# EAGLE design proto (EAGLE 7.2.0)
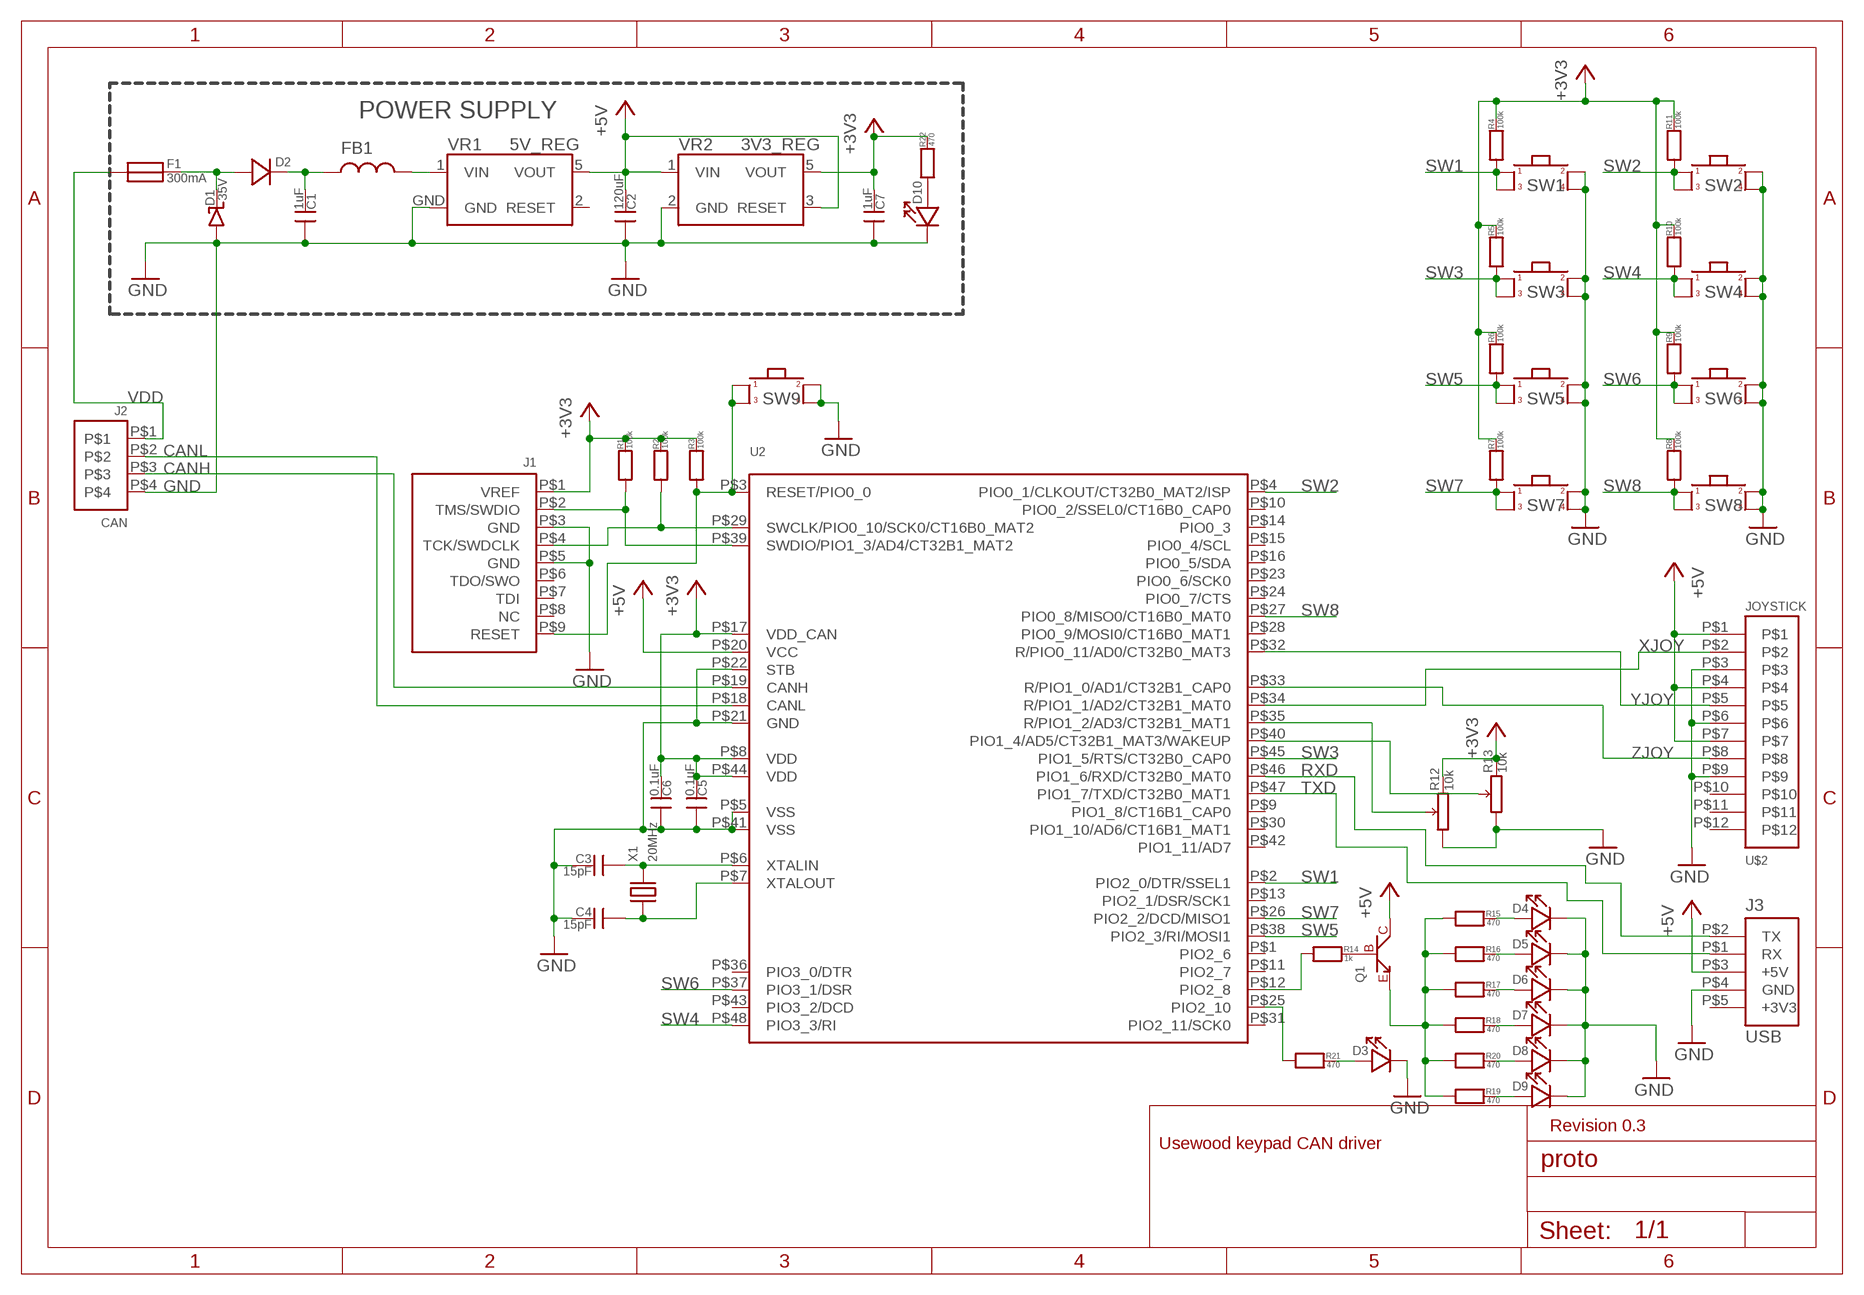
[diagram p0: schematic, sheet 1]

## Parts
C1  1uF  CAP0603  [0603]
C2  120uF  CAP0603  [0603]
C3  15pF  CAP0603  [0603]
C4  15pF  CAP0603  [0603]
C5  0.1uF  CAP0603  [0603]
C6  0.1uF  CAP0603  [0603]
C7  1uF  CAP0603  [0603]
D1  35V  DIODE_TVSDO-214AA  [DO-214AB]
D2  DIODEDO219AB  [DO219AB]
D3  LED0603  [0603]
D4  LED0603  [0603]
D5  LED0603  [0603]
D6  LED0603  [0603]
D7  LED0603  [0603]
D8  LED0603  [0603]
D9  LED0603  [0603]
D10  LED0603  [0603]
F1  300mA  FUSE100MA  [FUSE_100MA]
FB1  FERRITE0603  [0603]
J1  ARM_JTAG/SWD_HEADER_10_PINSMD  [ARM_10_PIN_JTAG/SWD_CONNECTOR]
J2  CAN  MOLEX_MICRO-FIT_4WAYTH  [MOLEX_MICRO-FIT_4WAY]
J3  USB  HEADER_USARTTH  [HEADER5_1]
Q1  NPN_TRANSISTORSOT323  [SOT323]
R1  100k  RES0603  [0603]
R2  100k  RES0603  [0603]
R3  100k  RES0603  [0603]
R4  100k  RES0603  [0603]
R5  100k  RES0603  [0603]
R6  100k  RES0603  [0603]
R7  100k  RES0603  [0603]
R8  100k  RES0603  [0603]
R9  100k  RES0603  [0603]
R10  100k  RES0603  [0603]
R11  100k  RES0603  [0603]
R12  10k  RES_POTRK09K1130C94  [RES_POT_RK09K1130C94]
R13  10k  RES_POTRK09K1130C94  [RES_POT_RK09K1130C94]
R14  1k  RES0603  [0603]
R15  470  RES0603  [0603]
R16  470  RES0603  [0603]
R17  470  RES0603  [0603]
R18  470  RES0603  [0603]
R19  470  RES0603  [0603]
R20  470  RES0603  [0603]
R21  470  RES0603  [0603]
R22  470  RES0603  [0603]
SW1  SWITCH12X12MM_CENTER_HOLE  [SWITCH_12X12MM_CENTER_HOLE]
SW2  SWITCH12X12MM_CENTER_HOLE  [SWITCH_12X12MM_CENTER_HOLE]
SW3  SWITCH12X12MM_CENTER_HOLE  [SWITCH_12X12MM_CENTER_HOLE]
SW4  SWITCH12X12MM_CENTER_HOLE  [SWITCH_12X12MM_CENTER_HOLE]
SW5  SWITCH12X12MM_CENTER_HOLE  [SWITCH_12X12MM_CENTER_HOLE]
SW6  SWITCH12X12MM_CENTER_HOLE  [SWITCH_12X12MM_CENTER_HOLE]
SW7  SWITCH12X12MM_CENTER_HOLE  [SWITCH_12X12MM_CENTER_HOLE]
SW8  SWITCH12X12MM_CENTER_HOLE  [SWITCH_12X12MM_CENTER_HOLE]
SW9  SWITCHREGULAR  [SWITCH_REGULAR]
U2  LPC11C22QFP48  [QFP48]
U$2  JOYSTICK  HEADER_MOLEX_MICRO-FIT  [MOLEX-43045-1000]
VR1  5V_REG  NCV8675175AA  [175AA]
VR2  3V3_REG  LP2985SOP5  [SOP5]
X1  20MHz  XTALSMD_5X3.2  [XTAL_SMD_5X3.2]

## Nets
+3V3: C5.1 C6.1 C7.1 J1.P$1(VREF) R1.1 R2.1 R3.1 R4.1 R5.1 R6.1 R7.1 R8.1 R9.1 R10.1 R11.1 R12.P$3 R13.P$3 R22.1 U2.P$8(VDD) U2.P$17(VDD_CAN) U2.P$44(VDD) VR2.5(VOUT)
+5V: C2.1 J3.P$3(+5V) Q1.M(C) U2.P$20(VCC) U$2.P$1 U$2.P$4 U$2.P$7 VR1.5(VOUT) VR2.1(VIN) VR2.3(RESET)
CANH: J2.P$3 U2.P$19(CANH)
CANL: J2.P$2 U2.P$18(CANL)
GND: C1.0 C2.0 C3.1 C4.1 C5.0 C6.0 C7.0 D1.P$1(P) D3.1 D4.1 D5.1 D6.1 D7.1 D8.1 D9.1 D10.1 J1.P$3(GND) J1.P$5(GND) J2.P$4 J3.P$4(GND) R12.P$1 R13.P$1 SW1.P$3 SW1.P$4 SW2.P$3 SW2.P$4 SW3.P$3 SW3.P$4 SW4.P$3 SW4.P$4 SW5.P$3 SW5.P$4 SW6.P$3 SW6.P$4 SW7.P$3 SW7.P$4 SW8.P$3 SW8.P$4 SW9.P$3 SW9.P$4 U2.P$5(VSS) U2.P$21(GND) U2.P$22(STB) U2.P$41(VSS) U$2.P$3 U$2.P$6 U$2.P$9 VR1.GND VR2.2(GND)
LED3: D3.0 R21.1
LED4: D4.0 R15.1
LED5: D5.0 R16.1
LED6: D6.0 R17.1
LED7: D7.0 R18.1
LED8: D8.0 R20.1
LED9: D9.0 R19.1
N$1: D1.P$2(N) D2.P$1(P) F1.P$2
N$2: C1.1 D2.P$2(N) FB1.0
N$3: D10.0 R22.0
N$4: FB1.1 VR1.1(VIN)
N$5: R14.0 U2.P$12(PIO2_8)
N$6: R21.0 U2.P$25(PIO2_10)
N$33: Q1.R(E) R15.0 R16.0 R17.0 R18.0 R19.0 R20.0
PIO1_2: R13.P$2 U2.P$40(PIO1_4/AD5/CT32B1_MAT3/WAKEUP)
PIO1_4: R12.P$2 U2.P$35(R/PIO1_2/AD3/CT32B1_MAT1)
Q1: Q1.L(B) R14.1
RESET: J1.P$9(RESET) R3.0 SW9.P$1 SW9.P$2 U2.P$3(RESET/PIO0_0)
RXD: J3.P$2(TX) U2.P$46(PIO1_6/RXD/CT32B0_MAT0)
SW1: R4.0 SW1.P$1 SW1.P$2 U2.P$2(PIO2_0/DTR/SSEL1)
SW2: R11.0 SW2.P$1 SW2.P$2 U2.P$4(PIO0_1/CLKOUT/CT32B0_MAT2/ISP)
SW3: R5.0 SW3.P$1 SW3.P$2 U2.P$45(PIO1_5/RTS/CT32B0_CAP0)
SW4: R10.0 SW4.P$1 SW4.P$2 U2.P$48(PIO3_3/RI)
SW5: R6.0 SW5.P$1 SW5.P$2 U2.P$38(PIO2_3/RI/MOSI1)
SW6: R9.0 SW6.P$1 SW6.P$2 U2.P$37(PIO3_1/DSR)
SW7: R7.0 SW7.P$1 SW7.P$2 U2.P$26(PIO2_2/DCD/MISO1)
SW8: R8.0 SW8.P$1 SW8.P$2 U2.P$27(PIO0_8/MISO0/CT16B0_MAT0)
SWDCLK: J1.P$4(TCK/SWDCLK) R2.0 U2.P$29(SWCLK/PIO0_10/SCK0/CT16B0_MAT2)
SWDIO: J1.P$2(TMS/SWDIO) R1.0 U2.P$39(SWDIO/PIO1_3/AD4/CT32B1_MAT2)
TXD: J3.P$1(RX) U2.P$47(PIO1_7/TXD/CT32B0_MAT1)
VDD: F1.P$1 J2.P$1
XJOY: U2.P$34(R/PIO1_1/AD2/CT32B1_MAT0) U$2.P$2
XTALIN: C3.0 U2.P$6(XTALIN) X1.P$2
XTALOUT: C4.0 U2.P$7(XTALOUT) X1.P$1
YJOY: U2.P$32(R/PIO0_11/AD0/CT32B0_MAT3) U$2.P$5
ZJOY: U2.P$33(R/PIO1_0/AD1/CT32B1_CAP0) U$2.P$8
Unconnected: J1.P$6(TDO/SWO) J1.P$7(TDI) J1.P$8(NC) J3.P$5(+3V3) U2.P$1(PIO2_6) U2.P$9(PIO1_8/CT16B1_CAP0) U2.P$10(PIO0_2/SSEL0/CT16B0_CAP0) U2.P$11(PIO2_7) U2.P$13(PIO2_1/DSR/SCK1) U2.P$14(PIO0_3) U2.P$15(PIO0_4/SCL) U2.P$16(PIO0_5/SDA) U2.P$23(PIO0_6/SCK0) U2.P$24(PIO0_7/CTS) U2.P$28(PIO0_9/MOSI0/CT16B0_MAT1) U2.P$30(PIO1_10/AD6/CT16B1_MAT1) U2.P$31(PIO2_11/SCK0) U2.P$36(PIO3_0/DTR) U2.P$42(PIO1_11/AD7) U2.P$43(PIO3_2/DCD) U$2.P$10 U$2.P$11 U$2.P$12 VR1.2(RESET)

## Notes on the sheet
- POWER SUPPLY
- Revision 0.3
- Usewood keypad CAN driver

## Library data of the parts
C1-C7 = usevolt:CAP
D1 = usevolt:DIODE_TVS
D2 = usevolt:DIODE
D3-D10 = usevolt:LED
F1 = usevolt:FUSE
FB1 = usevolt:FERRITE
J1 = usevolt:ARM_JTAG/SWD_HEADER_10_PIN: ARM Olimex Debugger 10 pin header, 0.05 inch
J2 = usevolt:MOLEX_MICRO-FIT_4WAY: MOLEX 43045-0401 HEADER, RIGHT ANGLE, DUAL ROW, 4 WAY, 1704306
J3 = usevolt:HEADER_USART: USB to USART module header
Q1 = usevolt:NPN_TRANSISTOR: http://www.farnell.com/datasheets/1697409.pdf 9294511
R1-R11 R14-R22 = usevolt:RES
R12 R13 = usevolt:RES_POT
SW1-SW9 = usevolt:SWITCH
U2 = usevolt:LPC11C22: NXP MCU, 32BIT, CORTEX-M0, 50MHZ, LQFP-48, 2314753
U$2 = usevolt:HEADER_MOLEX_MICRO-FIT: MOLEX HEADER, MICRO-FIT, R/A, DUAL ROW, 10 WAY, 1012255
VR1 = usevolt:NCV8675: ON SEMICONDUCTOR NCV8675DT50RKG LDO, 350MA, 5V, 5DPAK, 1885151
VR2 = usevolt:LP2985: TEXAS INSTRUMENTS LP2985IM5-3.3 V REG LDO +3.3V, SMD, 2985, SOT235
X1 = usevolt:XTAL

## Board
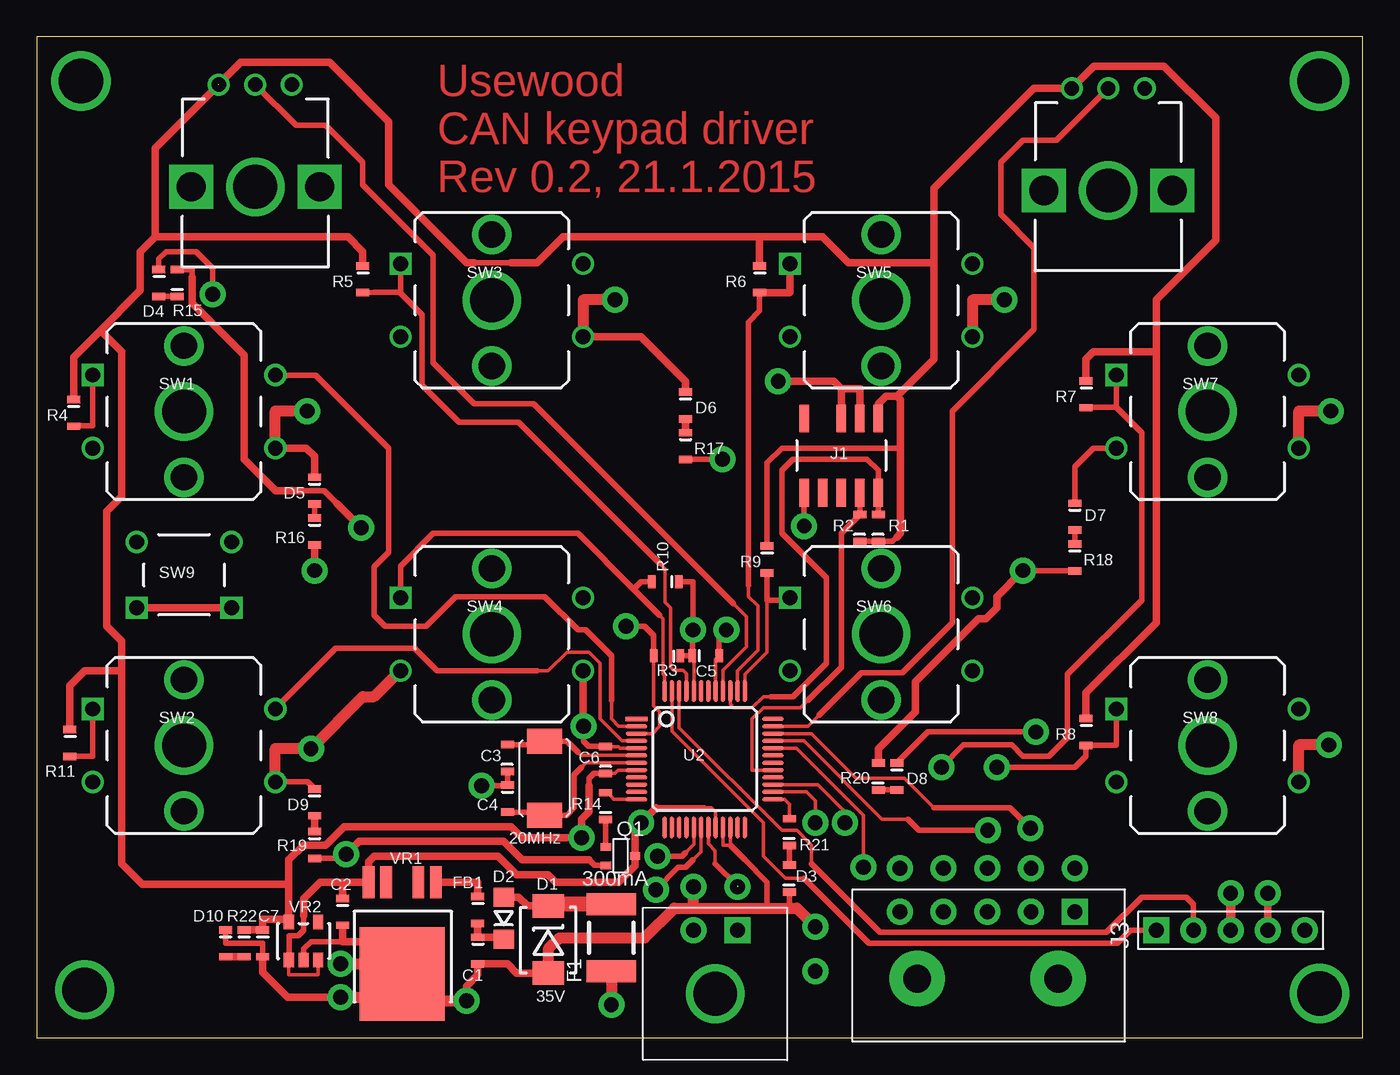
[diagram p1: board, top side]
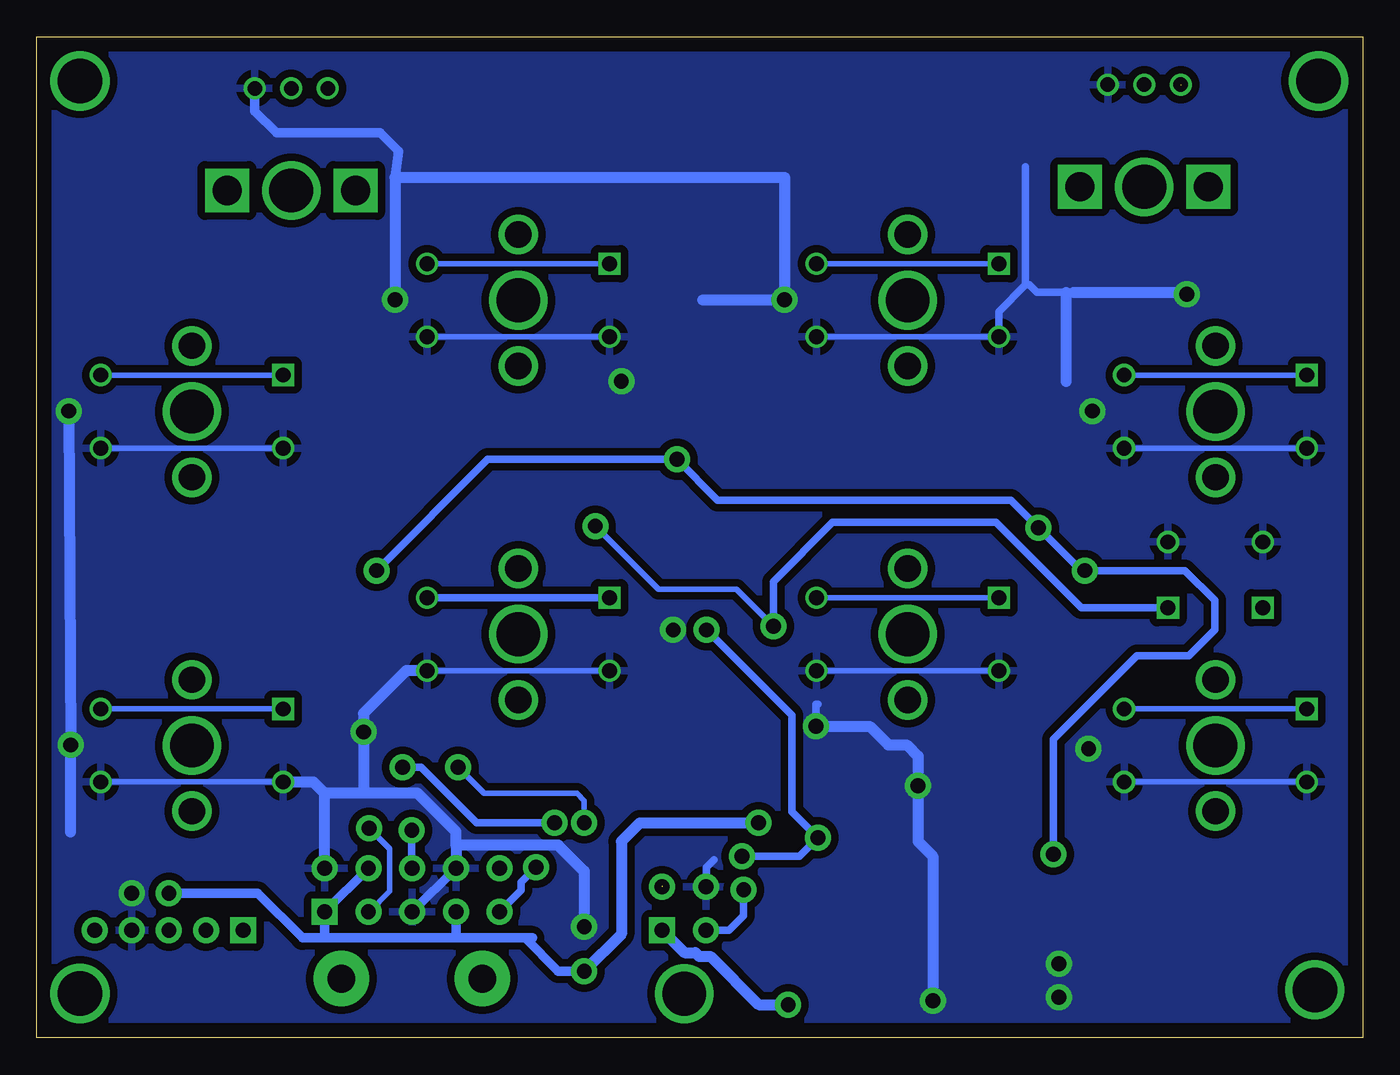
[diagram p2: board, bottom side, seen from below]

Size 90.86 x 68.57 mm. Coordinates in mm from the lower left corner, seen from the top.
Outline: 0,0 90.86,0 90.86,68.57 0,68.57 0,0
Copper layers (1*16): Top 0.035mm / dielectric 1.5mm / Bottom 0.035mm
Design rules "default *": minimum track width 10mil, minimum drill 24mil, track to track 8mil, track to pad 8mil, pad to pad 8mil, via to via 8mil, smd to smd 8mil, copper to edge 40mil, drill to drill 8mil, minimum pad ring 10mil, minimum via ring 8mil, stop-mask expansion 4mil, vias tented up to drill 0mil, thermal gap 20mil

### Footprints (pad centres in the part's own frame; a part is rotated, then mirrored left to right if it is on the bottom)
0603 = smd 0.508 x 0.889: 0 -1.041,0; 1 0.8,0
DO-214AB = smd 1.62 x 2.18: P$1 0,0; P$2 4.6,0
DO219AB = smd 1.3 x 1.4: P$1 0,0; P$2 2.9,0
FUSE_100MA = smd 1.5 x 3.41: P$1 0,0; P$2 4.572,0
ARM_10_PIN_JTAG/SWD_CONNECTOR = smd 1.905 x 0.635: P$1 -1.27,0; P$2 3.81,0; P$3 -1.27,-1.27; P$4 3.81,-1.27; P$5 -1.27,-2.54; P$6 3.81,-2.54; P$7 3.81,-3.81; P$8 -1.27,-5.08; P$9 3.81,-5.08
MOLEX_MICRO-FIT_4WAY = drill 1.016 pad 1.778 square: P$1 1.27,2.032 | drill 1.016 pad 1.778: P$2 -1.727,2.032; P$3 1.27,5.029; P$4 -1.727,5.029 | drill 3: P$5 -0.25,-2.3
HEADER5_1 = drill 1.016 pad 1.778 square: P$1 0,0 | drill 1.016 pad 1.778: P$2 0,-2.54; P$3 0,-5.08; P$4 0,-7.62; P$5 0,-10.16
SOT323 = smd 0.5 x 0.7: L 0,0; M 0.63,2; R 1.27,0
RES_POT_RK09K1130C94 = drill 1: P$1 -2.5,0; P$2 0,0; P$3 2.5,0 | drill 2 square: P$4 -4.4,7; P$5 4.4,7 | drill 3 pad 2.9: P$6 0,7
SWITCH_12X12MM_CENTER_HOLE = drill 1.016 square: P$1 -3,4.75 | drill 1.016: P$2 9.5,4.75; P$3 -3,-0.25; P$4 9.5,-0.25 | drill 3 pad 2.9: P$5 3.25,2.25 | drill 1.8 pad 1.7: P$10 3.25,6.75; P$11 3.25,-2.25
SWITCH_REGULAR = drill 1.016 square: P$1 0,0; P$2 6.5,0 | drill 1.016: P$3 6.5,4.5; P$4 0,4.5
QFP48 = smd 1.5 x 0.28: P$1 0.2,0; P$2 0.2,-0.5; P$3 0.2,-1; P$4 0.2,-1.5; P$5 0.2,-2; P$6 0.2,-2.5; P$7 0.2,-3; P$8 0.2,-3.5; P$9 0.2,-4; P$10 0.2,-4.5; P$11 0.2,-5; P$12 0.2,-5.5; P$25 9.55,-5.5; P$26 9.55,-5; P$27 9.55,-4.5; P$28 9.55,-4; P$29 9.55,-3.5; P$30 9.55,-3; P$31 9.55,-2.5; P$32 9.55,-2; P$33 9.55,-1.5; P$34 9.55,-1; P$35 9.55,-0.5; P$36 9.55,0 | smd 0.28 x 1.5: P$13 2.125,-7.425; P$14 2.625,-7.425; P$15 3.125,-7.425; P$16 3.625,-7.425; P$17 4.125,-7.425; P$18 4.625,-7.425; P$19 5.125,-7.425; P$20 5.625,-7.425; P$21 6.125,-7.425; P$22 6.625,-7.425; P$23 7.125,-7.425; P$24 7.625,-7.425; P$37 7.625,1.925; P$38 7.125,1.925; P$39 6.625,1.925; P$40 6.125,1.925; P$41 5.625,1.925; P$42 5.125,1.925; P$43 4.625,1.925; P$44 4.125,1.925; P$45 3.625,1.925; P$46 3.125,1.925; P$47 2.625,1.925; P$48 2.125,1.925
MOLEX-43045-1000 = drill 1.016 pad 1.778 square: P$1 0,-0.508 | drill 1.016 pad 1.778: P$2 -2.997,-0.508; P$3 -5.994,-0.508; P$4 -8.992,-0.508; P$5 -11.989,-0.508; P$6 0,2.489; P$7 -2.997,2.489; P$8 -5.994,2.489; P$9 -8.992,2.489; P$10 -11.989,2.489 | drill 1.905 pad 3.81: P$11 -10.795,-5.08; P$12 -1.143,-5.08
175AA = smd 2.2 x 0.8: 1 0,-2.2; 2 0,-1; 4 0,1.2; 5 0,2.4 | smd 6.4 x 5.8: GND -6.3,0.1
SOP5 = smd 0.7 x 1: 1 -1,0; 2 0,0; 3 1,0; 4 1,2.6; 5 -1,2.6
XTAL_SMD_5X3.2 = smd 1.7 x 2.4: P$1 -2.54,0; P$2 2.54,0

### Placement (x,y rotation side)
C1  30.23,6.1 90 top
C2  20.95,8.76 90 top
C3  32.26,19.05 270 top
C4  32.26,16.51 90 top
C5  45.72,26.16 180 top
C6  38.99,18.92 270 top
C7  15.49,6.6 90 top
D1  35.05,4.45 90 top
D2  32,9.65 270 top
D3  51.56,10.79 270 top
D4  8.38,51.82 90 top
D5  19.05,37.59 90 top
D6  44.45,43.43 90 top
D7  71.12,35.81 90 top
D8  58.93,18.03 90 top
D9  19.05,16.26 90 top
D10  12.95,6.6 90 top
F1  39.37,4.57 90 top
FB1  30.23,8.89 90 top
J1  57.66,41.15 270 top
J2  46.74,5.33 0 top
J3  76.71,7.37 90 top
Q1  38.99,13.08 270 top
R1  57.66,34.8 270 top
R2  56.39,34.8 270 top
R3  43.31,26.16 0 top
R4  2.54,42.93 90 top
R5  22.35,52.07 90 top
R6  49.53,52.07 90 top
R7  71.88,44.2 90 top
R8  71.88,21.08 90 top
R9  50.04,32.89 90 top
R10  43.18,31.24 0 top
R11  2.29,20.32 90 top
R12  73.41,65.02 180 top
R13  14.99,65.28 180 top
R14  38.99,15.75 270 top
R15  9.65,51.56 270 top
R16  19.05,34.8 90 top
R17  44.45,40.64 90 top
R18  71.12,33.02 90 top
R19  19.05,13.34 90 top
R20  57.66,17.78 270 top
R21  51.56,13.97 270 top
R22  14.22,6.6 90 top
SW1  6.86,40.64 0 top
SW2  6.86,17.78 0 top
SW3  27.94,48.26 0 top
SW4  27.94,25.4 0 top
SW5  54.61,48.26 0 top
SW6  54.61,25.4 0 top
SW7  76.96,40.64 0 top
SW8  76.96,17.78 0 top
SW9  6.86,29.46 0 top
U2  40.89,21.84 0 top
U$2  71.12,9.14 0 top
VR1  25.15,10.67 90 top
VR2  18.29,5.33 0 top
X1  34.8,17.78 90 top

### Tracks (layer width: path | path; a pad name or v marks a point on that pad's centre or on a via)
+3V3  (via drill 1.02 pad 1.78)  (1 unrouted)
  Top 0.254: U2.P$17 45.02,13.27 44.45,12.7 | U2.P$8 39.84,18.34 39.62,18.12 C6.1 | C5.1 45.02,26.06 U2.P$44
  Top 0.381: 44.45,12.7 44.2,12.45 v42.55,12.45 | 37.85,17.27 37.85,17.78 38.19,18.12 C6.1 | R3.1 C5.1 44.92,27.9 v44.96,27.94 44.96,31.24 R10.1 | 58.93,34.29 58.64,34 R1.1 R2.1 | R9.1 50.04,39.37 51.05,40.39 59.18,40.39 | 29.97,53.09 32.51,53.09
  Top 0.508: R22.1 C7.1 15.49,8.13 17.29,8.13 | 17.29,8.13 VR2.5 | 17.29,8.13 17.27,8.14 17.27,10.54 | 37.85,17.27 37.85,15.49 37.34,14.99 v37.34,13.72 33.27,13.72 32.51,14.48 21.08,14.48 19.81,13.21 18.29,13.21 17.27,12.19 17.27,10.54 | 17.27,10.54 7.24,10.54 5.84,11.94 5.84,25.15 | R4.1 2.54,46.61 4.25,48.33 | J1.P$1 57.66,43.43 58.17,43.94 58.93,43.94 | 58.93,43.94 61.47,46.48 61.47,53.09 | 61.47,53.09 61.47,58.17 68.33,65.02 R12.P$3 72.43,66.55 77.22,66.55 80.77,62.99 80.77,54.61 76.71,50.55 76.71,46.99 | R7.1 71.88,46.48 72.39,46.99 76.71,46.99 | R8.1 71.88,23.62 76.71,28.45 76.71,46.99 | 58.93,43.94 59.18,43.69 59.18,40.39 59.18,34.54 58.93,34.29 | 49.53,54.86 53.85,54.86 55.63,53.09 61.47,53.09 | 4.25,48.33 7.11,51.19 7.11,53.85 8.13,54.86 | 8.13,54.86 21.34,54.86 22.35,53.85 R5.1 | R13.P$3 8.13,60.92 8.13,54.86 | 12.45,65.28 13.97,66.8 20.07,66.8 24.13,62.74 24.13,58.42 29.46,53.09 29.97,53.09 | 32.51,53.09 34.29,53.09 36.07,54.86 49.53,54.86 | R6.1 49.53,54.86 | 4.25,48.33 4.51,48.33 5.84,46.99 5.84,37.08 4.83,36.07 4.83,28.19 5.84,27.18 5.84,25.15 | R11.1 2.29,24.13 3.3,25.15 5.84,25.15
  Bottom 0.508: v42.55,12.45 38.61,12.45 v37.34,13.72 39.12,15.49 39.12,22.1 v44.96,27.94
+5V  (via drill 1.02 pad 1.78)
  Top 0.254: VR2.3 19.29,4.32 17.27,4.32 17.27,5.33 VR2.1 | U2.P$20 46.52,15.46 46.23,15.75 45.72,15.75
  Top 0.381: VR2.1 17.29,6.99 17.91,6.99 18.29,7.37 18.29,8.38 | 42.42,15.75 45.72,15.75
  Top 0.508: VR1.5 22.75,10.3 | VR1.5 20.83,10.67 | 20.83,10.67 19.43,10.67 18.29,9.53 18.29,8.38 | C2.1 20.95,10.54 20.83,10.67 | 42.42,15.75 v41.4,14.73 40.99,14.32 Q1.M 40.99,11.78 39.88,10.67 35.56,10.67 35.05,11.18 32.89,11.18 31.62,12.45 23.11,12.45 22.75,12.08 VR1.5
  Top 0.635: v81.79,9.91 J3.P$3
  Bottom 0.635: 62.13,6.86 71.12,6.86 | 71.12,6.86 U$2.P$1 U$2.P$7 | U$2.P$4 62.13,6.86 | 71.12,6.86 72.64,6.86 75.69,9.91 v81.79,9.91 | 56.9,6.86 57.4,6.86 | 57.4,6.86 62.13,6.86 | v53.34,4.57 55.12,4.57 57.4,6.86
  Bottom 0.762: v41.4,14.73 49.53,14.73 50.8,13.46 50.8,7.11 v53.34,4.57
CANH  (1 unrouted)
  Top 0.254: 46.48,11.94 46.48,12.83 46.02,13.29 U2.P$19
  Top 0.381: 48.01,10.41 46.48,11.94
CANL  (via drill 1.02 pad 1.78)
  Top 0.254: U2.P$18 45.52,12.75 44.96,12.19
  Top 0.381: v42.42,10.16 43.94,11.68 44.45,11.68 44.96,12.19
  Bottom 0.508: J2.P$2 43.43,7.37 42.42,8.38 v42.42,10.16
GND  (via drill 1.02 pad 1.78)
  Top 0.254: U2.P$21 47.02,13.21 47.52,13.21 U2.P$22 | U2.P$5 39.97,19.84 39.88,19.94 39.01,19.94 C6.0 | C5.0 46.52,25.92 U2.P$41
  Top 0.381: 20.95,6.6 18.8,6.6 18.29,6.1 VR2.2 | C7.0 15.49,6.48 12.95,6.48 D10.1 | 47.52,13.21 48.54,12.19 48.51,12.19 50.04,10.67 50.04,8.89 | C3.1 C4.1 32.22,17.27 v30.48,17.27 | v12.06,50.93 12.06,52.7 10.92,53.85 8.89,53.85 8.38,53.34 D4.1 | C6.0 37.82,19.96 37.47,20.32 v37.47,21.34 | D8.1 61.05,20.95 v68.45,20.95 | D3.1 51.56,8.89 | C5.0 46.76,27.46 v47.24,27.94 | D7.1 71.12,39.12 72.39,40.39 SW7.P$3 | SW2.P$4 18.58,17.53 D9.1
  Top 0.508: 25.15,3.81 25.15,4.37 VR1.GND 23.62,4.37 | C2.0 20.95,6.6 23.62,6.6 23.62,5.08 23.62,4.37 | 23.37,3.3 23.62,3.56 23.62,4.37 | v29.46,2.54 29.46,3.56 30.23,4.32 C1.0 30.25,5.08 32.26,5.08 32.89,4.45 D1.P$1 34.42,4.45 | C7.0 15.49,4.5 17.2,2.79 v20.83,2.79 | D5.1 19.05,39.82 18.48,40.39 SW1.P$4 | D6.1 44.45,44.96 41.4,48.01 SW3.P$4 | J1.P$3 56.39,44.45 55.12,44.45 | 55.12,44.45 J1.P$5 | v50.8,44.96 54.61,44.96 55.12,44.45 | SW4.P$4 37.44,21.34 | 37.44,21.34 37.34,21.34 | 37.44,21.34 37.59,21.34 | v84.33,9.91 J3.P$4
  Top 0.762: 25.15,3.81 25.65,3.81 26.92,2.54 v29.46,2.54 | v20.83,2.79 22.86,2.79 23.37,3.3 | v20.83,5.08 23.62,5.08 | SW2.P$4 16.36,19.81 v18.8,19.81 22.35,23.37 23.11,23.37 24.89,25.15 | 44.96,8.89 43.69,8.89 41.66,6.86 35.81,6.86 35.05,6.1 D1.P$1 | 44.96,8.89 50.04,8.89 51.56,8.89 52.07,8.89 v53.34,7.62 | 86.46,17.12 SW8.P$4 86.46,20.07 v88.52,20.07 | SW7.P$4 86.46,42.93 v88.65,42.93 | SW5.P$4 64.11,50.55 v66.29,50.55 | SW3.P$4 37.44,50.55 v39.62,50.55 | v18.54,42.93 16.36,42.93 SW1.P$4 | J2.P$4 44.96,10.31 44.96,8.89
  Bottom 0.381: SW2.P$3 SW2.P$4 | SW1.P$4 SW1.P$3 | SW3.P$3 SW3.P$4 | SW5.P$3 SW5.P$4 | SW7.P$3 SW7.P$4 | SW8.P$3 SW8.P$4 | SW6.P$3 SW6.P$4 | SW4.P$3 SW4.P$4
  Bottom 0.508: v37.47,21.34 37.47,22.86 37.34,22.86 | 23.11,59.65 23.11,51.56 | 23.11,51.56 24.94,49.74 SW3.P$3 | 19.81,51.05 20.32,51.05 22.35,51.05 22.86,51.56 23.11,51.56 | 44.96,10.41 44.96,11.68 44.45,12.19
  Bottom 0.635: U$2.P$3 U$2.P$9 | 66.29,58.93 66.04,60.71 67.31,61.98 74.42,61.98 75.91,63.46 R12.P$1
  Bottom 0.762: 62.13,13.21 55.12,13.21 53.34,11.43 v53.34,7.62 | 62.13,13.21 U$2.P$9 | U$2.P$6 71.12,16.76 | v88.65,42.93 v88.52,20.07 88.52,14.1 | v66.29,50.55 66.29,58.93 39.62,58.93 v39.62,50.55 45.21,50.55 | 19.81,51.05 12.04,51.05 | v37.47,21.34 33.78,21.34 32.51,20.07 31.24,20.07 30.48,19.3 v30.48,17.27 30.48,13.46 29.46,12.45 v29.46,2.54 | 62.13,13.21 62.13,14.12 64.77,16.76 68.33,16.76 | 68.33,16.76 71.12,16.76 | 68.33,16.76 68.45,16.89 v68.45,20.95 68.45,22.23 65.53,25.15 SW6.P$4 | 71.12,16.76 71.88,17.53 SW8.P$3 | 20.32,44.96 20.32,51.05
  pour Bottom (isolate 0.508): 0,0 90.93,0 90.93,68.58 0,68.58
LED3
  Top 0.381: D3.0 R21.1
LED4
  Top 0.381: R15.1 9.64,50.77 D4.0
LED5
  Top 0.381: R16.1 D5.0
LED6
  Top 0.508: D6.0 R17.1
LED7
  Top 0.381: R18.1 D7.0
LED8
  Top 0.381: D8.0 58.91,16.98 R20.1
LED9
  Top 0.508: R19.1 D9.0
N$1
  Top 0.508: D2.P$1 33.02,9.65 33.63,9.04 D1.P$2
  Top 1.016: F1.P$2 35.91,9.14 D1.P$2
N$2
  Top 0.508: D2.P$2 31.86,6.9 C1.1 FB1.0
N$3
  Top 0.508: R22.0 D10.0
N$4
  Top 0.508: FB1.1 30.23,10.67 VR1.1
N$5
  Top 0.254: 39.09,16.79 39.37,16.51 39.54,16.34 U2.P$12
  Top 0.381: R14.0 39.09,16.79
N$6
  Top 0.254: U2.P$25 51.22,16.34 51.56,16 R21.0
N$7  (via drill 3.05)
  other vias: 87.88,3.05
N$8  (via drill 3.05)
  other vias: 3.3,3.3
N$9  (via drill 3.05)
  other vias: 3.05,65.53
N$10  (via drill 3.05)
  other vias: 87.88,65.53
N$33  (via drill 1.02 pad 1.78)
  Top 0.381: R18.0 67.54,31.98 v67.56,32 | R17.0 44.48,39.62 v46.99,39.62 | R15.0 10.67,52.6 10.67,52.07 | 37.85,12.19 38.23,11.81 Q1.R | v21.21,12.57 20.93,12.29 R19.0 | 18.16,37.47 19.69,37.47 20.57,36.58
  Top 0.508: 67.54,31.98 65.79,30.23 65.79,29.46 65.02,28.7 64.52,28.7 60.2,24.38 60.2,22.35 57.66,19.81 R20.0 | 37.85,12.19 33.27,12.19 32,13.46 22.1,13.46 v21.21,12.57 | R16.0 v19.05,32 | 10.67,52.07 10.67,50.29 14.22,46.74 14.22,39.62 16.38,37.47 18.16,37.47 | 20.57,36.58 v22.23,34.92
  Bottom 0.508: v67.56,32 59.94,39.62 v46.99,39.62 44.2,36.83 24.13,36.83 v22.23,34.92 19.3,32 v19.05,32 12.19,32 10.16,29.97 10.16,27.94 11.94,26.16 15.49,26.16 21.21,20.45 v21.21,12.57
PIO1_2
  Top 0.254: U2.P$40 47.02,25.18 48.64,26.8 48.64,28.83 47.75,29.72
  Top 0.381: 47.75,29.72 34.04,43.43 29.97,43.43 27.18,46.23 27.18,53.59 22.35,58.42 22.35,59.94 19.81,62.48 17.78,62.48 R13.P$2
PIO1_4
  Top 0.254: U2.P$35 52.84,21.34 53.59,22.1
  Top 0.381: 53.59,22.1 56.52,25.02 59.31,25.02 62.74,28.45 62.74,42.93 68.33,48.51 68.33,54.1 66.04,56.39 66.04,59.94 67.56,61.47 69.85,61.47 R12.P$2
Q1
  Top 0.381: Q1.L R14.1
RESET  (via drill 1.02 pad 1.78)
  Top 0.254: R3.0 42.27,22.76 42.67,22.35 42.67,21.34 42.18,20.84 U2.P$3
  Top 0.381: J1.P$9 v52.58,35.05 | R3.0 42.27,27.58 41.66,28.19 v40.39,28.19
  Top 0.508: SW9.P$1 SW9.P$2
  Bottom 0.381: v52.58,35.05 48.26,30.73 42.93,30.73 v40.39,28.19
  Bottom 0.508: v40.39,28.19 40.39,31.24 36.32,35.31 25.15,35.31 19.3,29.46 SW9.P$2
RXD
  Top 0.254: U2.P$46 44.02,21.26 51.05,14.22 52.07,14.22 53.09,13.21 53.09,11.94
  Top 0.381: 53.09,11.94 57.79,7.24 73.28,7.24 75.69,9.65 78.74,9.65 79.25,9.14 J3.P$2
SW1
  Top 0.254: U2.P$2 39.87,21.34 39.37,21.84 39.37,23.11
  Top 0.381: SW1.P$1 3.86,41.91 2.56,41.91 R4.0 | 39.37,23.11 39.37,26.16 37.59,27.94 37.08,27.94 34.8,30.23 28.7,30.23 26.67,28.19 23.88,28.19 23.11,28.96 23.11,32.26 24.13,33.27 24.13,40.39 19.13,45.39 SW1.P$2
  Bottom 0.381: SW1.P$1 SW1.P$2
SW2
  Top 0.254: U2.P$4 40.11,20.34 38.61,21.84 38.61,25.65 37.85,26.42 36.32,26.42 35.05,25.15 34.29,25.15
  Top 0.381: SW2.P$1 3.86,19.3 3.83,19.28 R11.0 | 34.29,25.15 27.43,25.15 25.91,26.67 20.5,26.67 SW2.P$2
  Bottom 0.381: SW2.P$2 SW2.P$1
SW3
  Top 0.254: U2.P$45 44.52,24.95 44.28,25.19 43.65,25.19 43.43,25.4 43.43,29.46 43.05,29.84 43.05,32.13 42.67,32.51
  Top 0.381: SW3.P$1 24.94,51.05 | R5.0 23.14,51.05 24.94,51.05 | 42.67,32.51 33.02,42.16 28.96,42.16 26.42,44.7 26.42,49.53 24.94,51.01 24.94,51.05
  Bottom 0.381: SW3.P$1 SW3.P$2
SW4
  Top 0.254: U2.P$48 43.02,24.8 42.93,24.89 42.93,28.7 42.67,28.96
  Top 0.381: 40.89,30.73 42.67,28.96 | R10.0 41.4,31.24 40.89,30.73 | 40.89,30.73 37.08,34.54 27.18,34.54 24.94,32.31 SW4.P$1
  Bottom 0.381: SW4.P$2 SW4.P$1
SW5
  Top 0.254: U2.P$38 48.01,23.78 48.01,25.15 49.4,26.54 49.4,29.59 48.77,30.23 48.77,30.99
  Top 0.381: R6.0 49.53,49.78 48.77,49.02 48.77,30.99
  Top 0.508: SW5.P$1 51.61,51.05 51.59,51.03 R6.0
  Bottom 0.381: SW5.P$2 SW5.P$1
SW6
  Top 0.254: U2.P$37 48.52,24.9 50.04,26.42 50.04,29.97
  Top 0.381: SW6.P$1 51.43,29.97 50.04,29.97 R9.0
  Bottom 0.508: SW6.P$2 SW6.P$1
SW7  (via drill 1.02 pad 1.78)
  Top 0.254: v53.34,14.73 53.34,16.26 52.75,16.84 U2.P$26
  Top 0.381: SW7.P$1 73.96,43.18 | R7.0 71.91,43.18 73.96,43.18 | v61.98,18.54 63.5,20.07 66.8,20.07 67.56,19.3 69.34,19.3 70.61,20.57 70.61,24.89 75.69,29.97 75.69,41.45 73.96,43.18
  Bottom 0.381: v61.98,18.54 60.2,16.76 53.85,16.76 53.34,16.26 v53.34,14.73 | SW7.P$1 SW7.P$2
SW8  (via drill 1.02 pad 1.78)
  Top 0.254: U2.P$27 53.52,17.34 55.37,15.49 v55.37,14.73
  Top 0.381: SW8.P$1 73.96,20.07 73.94,20.04 R8.0 71.88,19.3 71.12,18.54 v65.79,18.54
  Bottom 0.381: SW8.P$1 SW8.P$2
  Bottom 0.508: v65.79,18.54 64.52,18.54 60.71,14.73 v55.37,14.73
SWDCLK
  Top 0.254: U2.P$29 49.02,18.34 49.02,21.84 49.78,22.61 52.32,22.61 52.83,23.11
  Top 0.381: 52.83,23.11 55.12,25.4 55.12,34.57 R2.0 J1.P$4
SWDIO
  Top 0.254: U2.P$39 47.52,22.84 47.75,22.61 49.02,22.61 49.78,23.37 50.29,23.37
  Top 0.381: R1.0 J1.P$2 57.66,38.86 56.9,39.62 51.82,39.62 51.05,38.86 51.05,34.54 54.1,31.5 54.1,25.65 51.82,23.37 50.29,23.37
TXD
  Top 0.254: U2.P$47 43.52,21 49.78,14.73 49.78,12.45 51.31,10.92 52.58,10.92
  Top 0.381: 52.58,10.92 57.02,6.48 74.04,6.48 74.93,7.37 J3.P$1
VDD  (via drill 1.02 pad 1.78)
  Top 0.762: F1.P$1 v39.37,2.29
  Bottom 0.762: J2.P$1 46.48,5.84 45.72,5.84 45.47,5.59 44.7,5.59 41.4,2.29 v39.37,2.29
XJOY  (via drill 1.02 pad 1.78)
  Top 0.254: U2.P$34 53.07,20.84 53.34,20.57 56.13,17.78 59.44,17.78 61.47,15.75
  Top 0.381: 61.47,15.75 66.67,15.75 v68.07,14.35
  Bottom 0.381: v68.07,14.35 66.67,12.95 66.67,10.03 68.12,8.59 U$2.P$2
XTALIN
  Top 0.254: U2.P$6 37.3,19.34 37.08,19.56
  Top 0.381: C3.0 34.57,20.09 X1.P$2 36.32,20.32 37.08,19.56
XTALOUT
  Top 0.254: 37.34,18.54 37.64,18.84 U2.P$7
  Top 0.381: C4.0 34.57,15.47 X1.P$1 36.32,15.24 36.83,15.75 36.83,18.03 37.34,18.54
YJOY  (via drill 1.02 pad 1.78)
  Top 0.254: v56.64,11.68 56.64,15.24 52.32,19.56 52.04,19.84 U2.P$32
  Bottom 0.508: v56.64,11.68 57.66,10.67 57.66,10.11 U$2.P$5
ZJOY  (via drill 1.02 pad 1.78)
  Top 0.254: U2.P$33 52.55,20.34 52.83,20.07 57.91,14.99 59.69,14.99
  Top 0.381: 59.69,14.99 60.45,14.22 v65.15,14.22
  Bottom 0.381: 65.15,11.66 U$2.P$8
  Bottom 0.508: v65.15,14.22 65.15,11.66

### Text on the board
Top: Usewood / CAN keypad driver / Rev 0.2, 21.1.2015